# EAGLE schematic MouseGoggles Hat-1-9 (EAGLE 9.6.2)
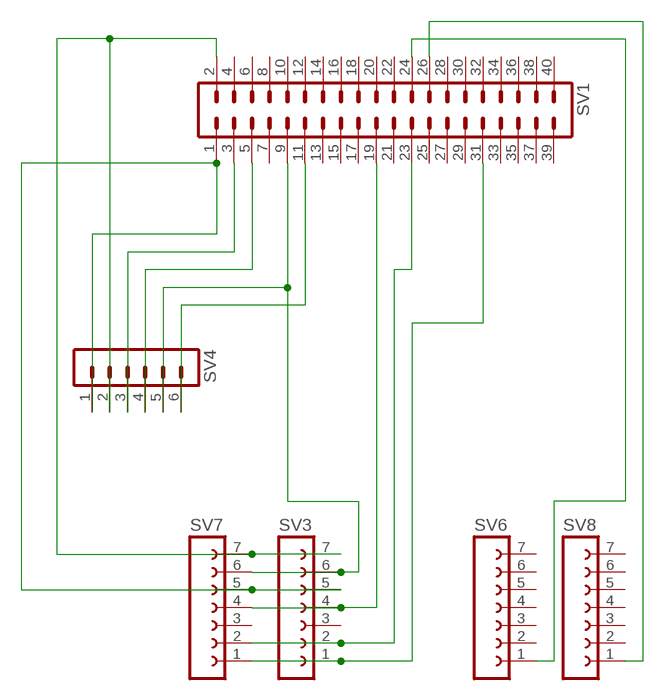
[diagram p0: schematic, sheet 1]

## Parts
SV1  MA20-2  [MA20-2]
SV3  FE07-1  [FE07]
SV4  MA06-1  [MA06-1]
SV6  FE07-1  [FE07]
SV7  FE07-1  [FE07]
SV8  FE07-1  [FE07]

## Nets
N$1: SV1.1 SV3.5 SV4.1 SV7.5
N$2: SV1.9 SV3.6 SV4.5 SV7.6
N$4: SV1.23 SV3.2 SV7.2
N$5: SV1.24 SV6.1
N$6: SV1.26 SV8.1
N$7: SV1.31 SV3.1 SV7.1
N$8: SV1.19 SV3.4 SV7.4
N$9: SV1.3 SV4.3
N$10: SV1.5 SV4.4
N$11: SV1.11 SV4.6
N$13: SV1.2 SV3.7 SV4.2 SV7.7
Unconnected: SV1.4 SV1.6 SV1.7 SV1.8 SV1.10 SV1.12 SV1.13 SV1.14 SV1.15 SV1.16 SV1.17 SV1.18 SV1.20 SV1.21 SV1.22 SV1.25 SV1.27 SV1.28 SV1.29 SV1.30 SV1.32 SV1.33 SV1.34 SV1.35 SV1.36 SV1.37 SV1.38 SV1.39 SV1.40 SV3.3 SV6.2 SV6.3 SV6.4 SV6.5 SV6.6 SV6.7 SV7.3 SV8.2 SV8.3 SV8.4 SV8.5 SV8.6 SV8.7

## Library data of the parts
SV1 = con-lstb:MA20-2: PIN HEADER; OC_FARNELL: unknown; OC_NEWARK: unknown
SV3 SV6-SV8 = con-lsta:FE07-1: FEMALE HEADER; OC_FARNELL: unknown; OC_NEWARK: unknown
SV4 = con-lstb:MA06-1: PIN HEADER; OC_FARNELL: unknown; OC_NEWARK: unknown